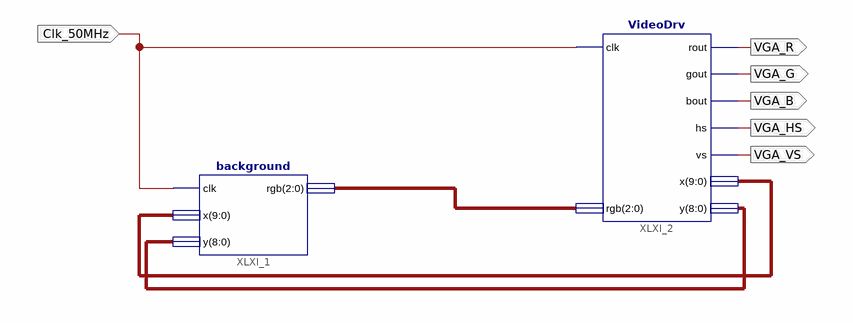
[diagram p0: schematic sheet 1]
// Xilinx ISE schematic Schema.sch (spartan3e) as structural Verilog: 2 symbols, 6 ports
module Schema (
  input  Clk_50MHz,
  output VGA_R,
  output VGA_G,
  output VGA_B,
  output VGA_HS,
  output VGA_VS
);

  wire [2:0] XLXN_1;
  wire [8:0] XLXN_3;
  wire [9:0] XLXN_2;

  background XLXI_1 (.clk(Clk_50MHz), .x(XLXN_2), .y(XLXN_3), .rgb(XLXN_1));
  VideoDrv XLXI_2 (
    .clk(Clk_50MHz), .rgb(XLXN_1), .rout(VGA_R), .gout(VGA_G), .bout(VGA_B), .hs(VGA_HS), .vs(VGA_VS),
    .x(XLXN_2), .y(XLXN_3));
endmodule
